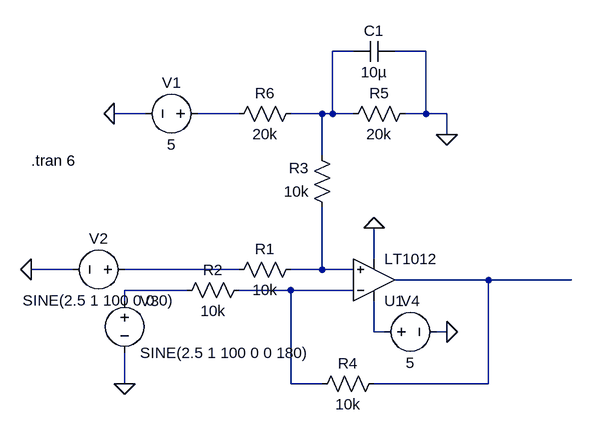
[diagram p0: schematic AudioDiffAmpSeatside.asc]
AudioDiffAmpSeatside.asc, the LTspice schematic file:
Version 4
SHEET 1 880 680
WIRE 256 -48 224 -48
WIRE 368 -48 320 -48
WIRE -64 48 -112 48
WIRE 80 48 16 48
WIRE 208 48 160 48
WIRE 224 48 224 -48
WIRE 224 48 208 48
WIRE 256 48 224 48
WIRE 368 48 368 -48
WIRE 368 48 336 48
WIRE 400 48 368 48
WIRE 400 80 400 48
WIRE 208 112 208 48
WIRE 288 272 288 224
WIRE -176 288 -240 288
WIRE 80 288 -96 288
WIRE 208 288 208 192
WIRE 208 288 160 288
WIRE 256 288 208 288
WIRE 464 304 320 304
WIRE 592 304 464 304
WIRE 0 320 -96 320
WIRE 160 320 80 320
WIRE 256 320 160 320
WIRE -96 336 -96 320
WIRE 288 384 288 336
WIRE 304 384 288 384
WIRE 400 384 384 384
WIRE -96 464 -96 416
WIRE 160 464 160 320
WIRE 208 464 160 464
WIRE 464 464 464 304
WIRE 464 464 288 464
FLAG 400 80 0
FLAG -96 464 0
FLAG -240 288 0
FLAG -112 48 0
FLAG 288 224 0
FLAG 400 384 0
SYMBOL Res 176 272 R90
WINDOW 0 0 56 VBottom 2
WINDOW 3 32 56 VTop 2
SYMATTR InstName R1
SYMATTR Value 10k
SYMBOL Res 96 304 R90
WINDOW 0 0 56 VBottom 2
WINDOW 3 32 56 VTop 2
SYMATTR InstName R2
SYMATTR Value 10k
SYMBOL Res 224 208 R180
WINDOW 0 36 76 Left 2
WINDOW 3 36 40 Left 2
SYMATTR InstName R3
SYMATTR Value 10k
SYMBOL Res 192 480 R270
WINDOW 0 32 56 VTop 2
WINDOW 3 0 56 VBottom 2
SYMATTR InstName R4
SYMATTR Value 10k
SYMBOL LT1012 288 368 M180
SYMATTR InstName U1
SYMBOL Res 352 32 R90
WINDOW 0 0 56 VBottom 2
WINDOW 3 32 56 VTop 2
SYMATTR InstName R5
SYMATTR Value 20k
SYMBOL Res 176 32 R90
WINDOW 0 0 56 VBottom 2
WINDOW 3 32 56 VTop 2
SYMATTR InstName R6
SYMATTR Value 20k
SYMBOL Cap 320 -64 R90
WINDOW 0 0 32 VBottom 2
WINDOW 3 32 32 VTop 2
SYMATTR InstName C1
SYMATTR Value 10µ
SYMBOL Voltage 32 48 R90
WINDOW 0 -32 56 VBottom 2
WINDOW 3 32 56 VTop 2
SYMATTR InstName V1
SYMATTR Value 5
SYMBOL Voltage -80 288 R90
WINDOW 0 -32 56 VBottom 2
WINDOW 3 32 56 VTop 2
SYMATTR InstName V2
SYMATTR Value SINE(2.5 1 100 0 0 0)
SYMBOL Voltage -96 320 R0
SYMATTR InstName V3
SYMATTR Value SINE(2.5 1 100 0 0 180)
SYMBOL Voltage 288 384 R270
WINDOW 0 32 56 VTop 2
WINDOW 3 -32 56 VBottom 2
SYMATTR InstName V4
SYMATTR Value 5
TEXT -240 120 Left 2 !.tran 6

The netlist it stands for:
* AudioDiffAmpSeatside.asc
R1 N004 N003 10k
R2 N007 N006 10k
R3 N004 N001 10k
R4 N007 N005 10k
* U1: LT1012 (symbol LT1012 not available, pins judged from their places): In+=N004 In-=N007 V+=N008 V-=0 OUT=N005
R5 0 N001 20k
R6 N001 N002 20k
C1 0 N001 10µ
V1 N002 0 5
V2 N003 0 SINE(2.5 1 100 0 0 0)
V3 N006 0 SINE(2.5 1 100 0 0 180)
V4 N008 0 5
.tran 6
.backanno
.end